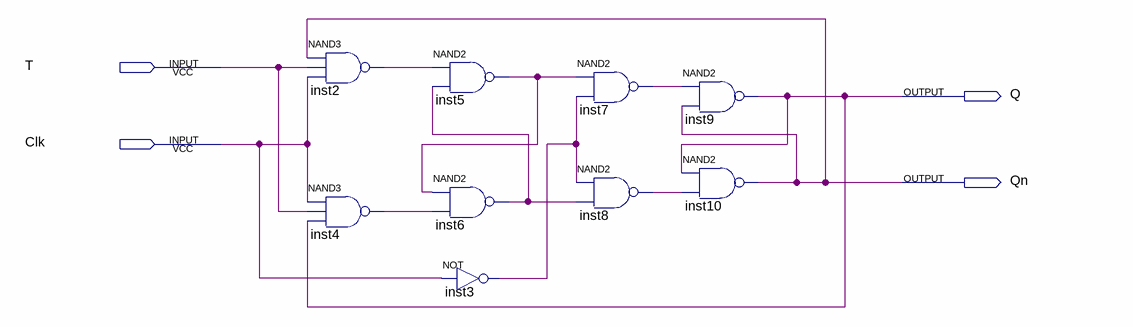
[diagram p0: schematic sheet]
// Quartus schematic Master_slave_t_ff.bdf as structural Verilog: 9 symbols, 4 pins
module Master_slave_t_ff (
  input  T,
  input  Clk,
  output Q,
  output Qn
);

  wire inst2_out, inst3_out, inst4_out, inst5_out, inst6_out, inst7_out, inst8_out;

  nand inst2 (inst2_out, Qn, T, Clk);
  nand inst4 (inst4_out, Clk, T, Q);
  nand inst5 (inst5_out, inst2_out, inst6_out);
  nand inst6 (inst6_out, inst5_out, inst4_out);
  not inst3 (inst3_out, Clk);
  nand inst7 (inst7_out, inst5_out, inst3_out);
  nand inst8 (inst8_out, inst3_out, inst6_out);
  nand inst9 (Q, inst7_out, Qn);
  nand inst10 (Qn, Q, inst8_out);
endmodule
